# Altium schematic sheet baseband.SchDoc
size 297 x 209 mm
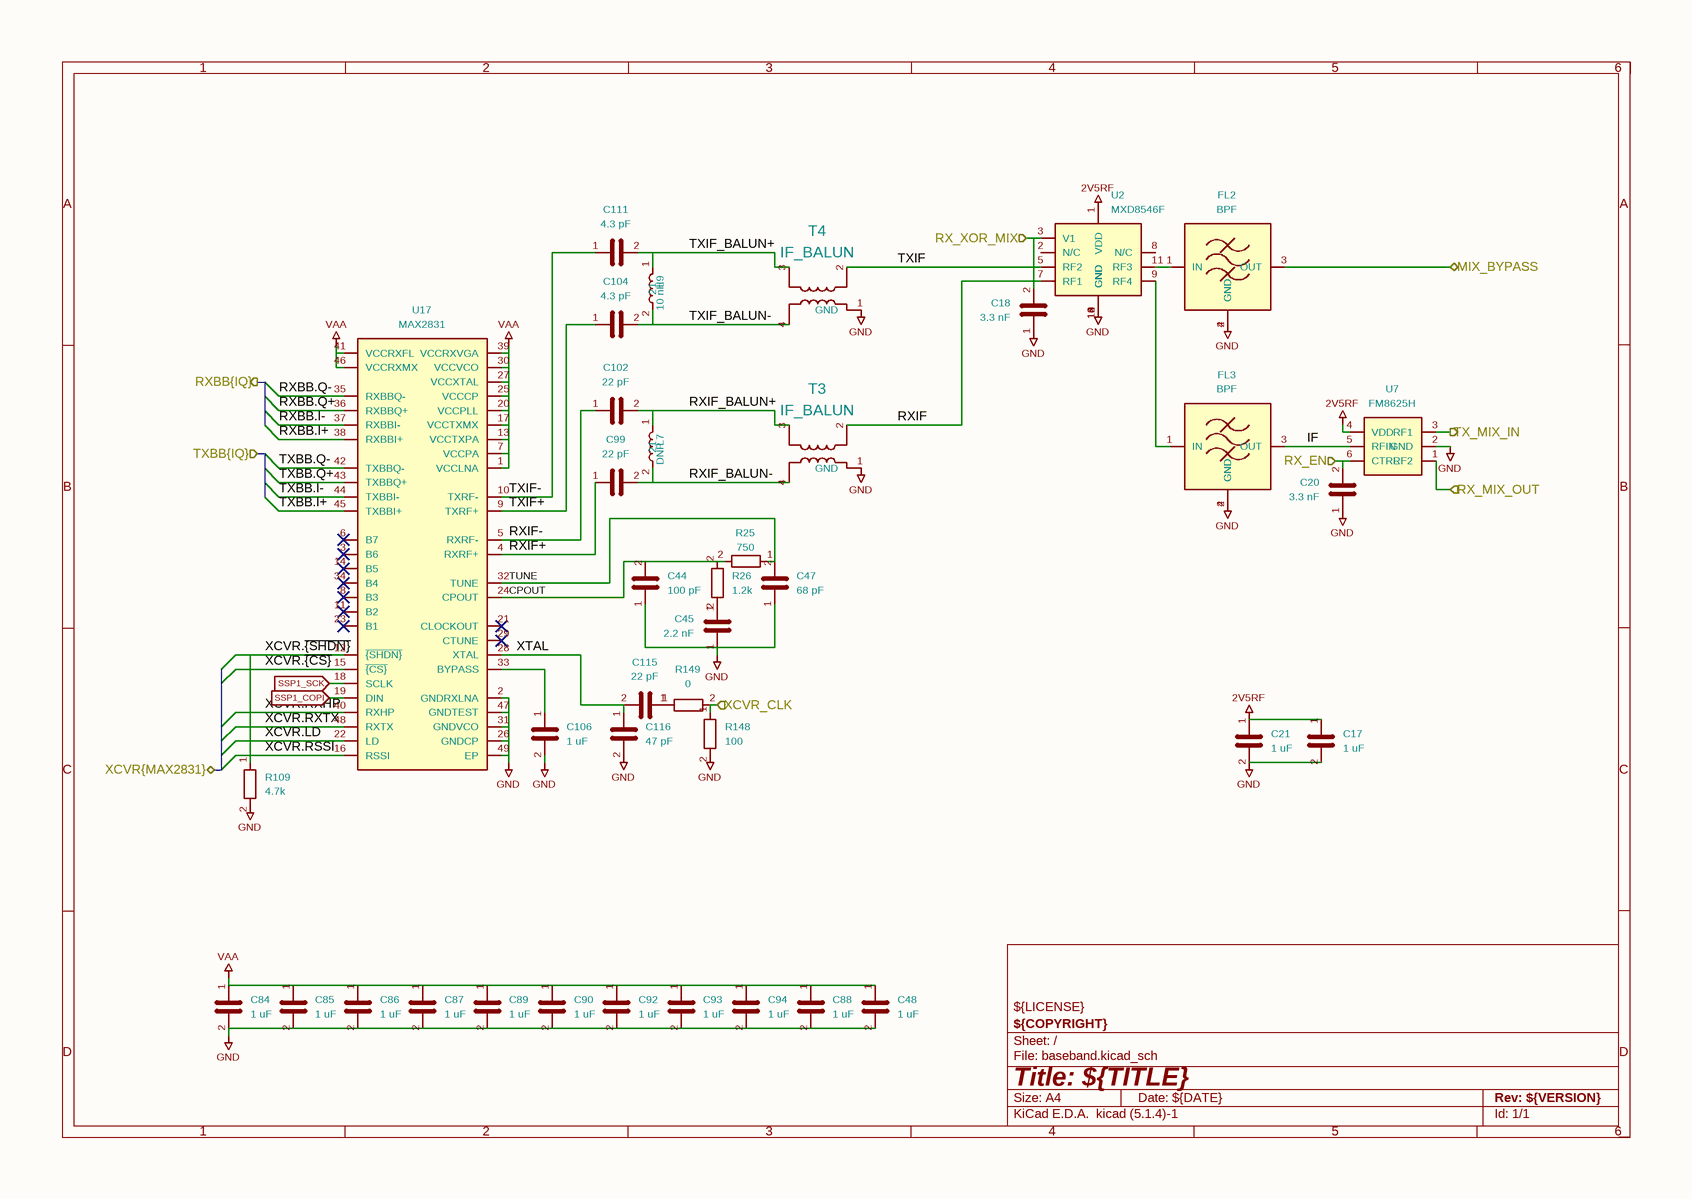
[diagram p0: baseband.SchDoc]

## Parts
C17  1 uF  [C_0201_0603Metric]
C18  3.3 nF  [C_0201_0603Metric]
C20  3.3 nF  [C_0201_0603Metric]
C21  1 uF  [C_0201_0603Metric]
C44  100 pF  [C_0201_0603Metric]
C45  2.2 nF  [C_0201_0603Metric]
C47  68 pF  [C_0201_0603Metric]
C48  1 uF  [C_0201_0603Metric]
C84  1 uF  [C_0201_0603Metric]
C85  1 uF  [C_0201_0603Metric]
C86  1 uF  [C_0201_0603Metric]
C87  1 uF  [C_0201_0603Metric]
C88  1 uF  [C_0201_0603Metric]
C89  1 uF  [C_0201_0603Metric]
C90  1 uF  [C_0201_0603Metric]
C92  1 uF  [C_0201_0603Metric]
C93  1 uF  [C_0201_0603Metric]
C94  1 uF  [C_0201_0603Metric]
C99  22 pF  [C_0201_0603Metric]
C102  22 pF  [C_0201_0603Metric]
C104  4.3 pF  [C_0201_0603Metric]
C106  1 uF  [C_0201_0603Metric]
C111  4.3 pF  [C_0201_0603Metric]
C115  22 pF  [C_0201_0603Metric]
C116  47 pF  [C_0201_0603Metric]
FL2  BPF  [Filter_Pulse_BPF1608LM09R5000A]
FL3  BPF  [Filter_Pulse_BPF1608LM09R5000A]
L7  DNP  [L_0201_0603Metric]
L9  10 nH  [L_0201_0603Metric]
R25  750  [R_0201_0603Metric]
R26  1.2k  [R_0201_0603Metric]
R109  4.7k  [R_0201_0603Metric]
R148  100  [R_0201_0603Metric]
R149  0  [R_0201_0603Metric]
T3  IF_BALUN  [Balun_TDK_TFSZ06052460-3310A2X]
T4  IF_BALUN  [Balun_TDK_TFSZ06052460-3310A2X]
U2  MXD8546F  [QFN-12-1EP_2x2mm_P0.5mm_EP1x1mm]
U7  FM8625H  [TSLP-6-4_1.1x0.7mm_P0.4mm]
U17  MAX2831  [QFN-48-1EP_7x7mm_P0.5mm_EP5.6x5.6mm_ThermalVias]

## Ports
MIX_BYPASS (bidir), RX_EN (in), RX_MIX_OUT (in), RX_XOR_MIX (in), RXBB{IQ} (out), SSP1_COPI (in), SSP1_SCK (in), TX_MIX_IN (out), TXBB{IQ} (in), XCVR_CLK (in), XCVR{MAX2831} (bidir)

## Nets
2V5RF: C17.1 C21.1 U2.1(VDD) U7.4(VDD)
GND: C17.2 C18.1 C20.1 C21.2 C44.1 C45.1 C47.1 C48.2 C84.2 C85.2 C86.2 C87.2 C88.2 C89.2 C90.2 C92.2 C93.2 C94.2 C106.2 C116.2 FL2.2(GND) FL2.4(GND) FL3.2(GND) FL3.4(GND) R109.2 R148.2 T3.1(GND) T4.1(GND) U2.4(GND) U2.6(GND) U2.10(GND) U2.12(GND) U2.13(GND) U7.2(GND) U17.2(GNDRXLNA) U17.26(GNDCP) U17.31(GNDVCO) U17.47(GNDTEST) U17.49(EP)
VAA: C48.1 C84.1 C85.1 C86.1 C87.1 C88.1 C89.1 C90.1 C92.1 C93.1 C94.1 U17.1(VCCLNA) U17.7(VCCPA) U17.13(VCCTXPA) U17.17(VCCTXMX) U17.20(VCCPLL) U17.25(VCCCP) U17.27(VCCXTAL) U17.30(VCCVCO) U17.39(VCCRXVGA) U17.41(VCCRXFL) U17.46(VCCRXMX)
CPOUT: C44.2 R25.2 R26.2 U17.24(CPOUT)
IF: FL3.3(OUT) U7.5(RFIN)
MIX_BYPASS: FL2.3(OUT) ; port MIX_BYPASS
RX_EN: C20.2 U7.6(CTRL) ; port RX_EN
RX_MIX_OUT: U7.1(RF2) ; port RX_MIX_OUT
RX_XOR_MIX: C18.2 U2.3(V1) ; port RX_XOR_MIX
RXBB.I+: U17.38(RXBBI+)
RXBB.I-: U17.37(RXBBI-)
RXBB.Q+: U17.36(RXBBQ+)
RXBB.Q-: U17.35(RXBBQ-)
RXIF: T3.2 U2.7(RF1)
RXIF+: C99.1 U17.4(RXRF+)
RXIF-: C102.1 U17.5(RXRF-)
RXIF_BALUN+: C102.2 L7.1 T3.3
RXIF_BALUN-: C99.2 L7.2 T3.4
SSP1_COPI: U17.19(DIN) ; port SSP1_COPI
SSP1_SCK: U17.18(SCLK) ; port SSP1_SCK
TUNE: C47.2 R25.1 U17.32(TUNE)
TX_MIX_IN: U7.3(RF1) ; port TX_MIX_IN
TXBB.I+: U17.45(TXBBI+)
TXBB.I-: U17.44(TXBBI-)
TXBB.Q+: U17.43(TXBBQ+)
TXBB.Q-: U17.42(TXBBQ-)
TXIF: T4.2 U2.5(RF2)
TXIF+: C104.1 U17.9(TXRF+)
TXIF-: C111.1 U17.10(TXRF-)
TXIF_BALUN+: C111.2 L9.1 T4.3
TXIF_BALUN-: C104.2 L9.2 T4.4
XCVR.LD: U17.22(LD)
XCVR.RSSI: U17.16(RSSI)
XCVR.RXHP: U17.40(RXHP)
XCVR.RXTX: U17.48(RXTX)
XCVR.~{{CS}}: U17.15(~{{CS}})
XCVR.~{{SHDN}}: R109.1 U17.12(~{{SHDN}})
XCVR_CLK: R148.1 R149.2 ; port XCVR_CLK
XTAL: C115.2 C116.1 U17.28(XTAL)
NetC45_2: C45.2 R26.1
NetC106_1: C106.1 U17.33(BYPASS)
NetC115_1: C115.1 R149.1
NetFL2_1: FL2.1(IN) U2.11(RF3)
NetFL3_1: FL3.1(IN) U2.9(RF4)

Not connected (* = marked no-connect by the designer): U2 2(N/C) 8(N/C); U17 3(B6)* 6(B7)* 8(B3)* 11(B2)* 14(B5)* 21(CLOCKOUT)* 23(B1)* 29(CTUNE)* 34(B4)*

## Notes on the sheet
- 1
- 2
- 3
- 4
- 5
- 6
- A
- B
- C
- ${LICENSE}
- D
- Title: ${TITLE}
- File: baseband.kicad_sch
- Sheet: /
- ${COPYRIGHT}
- KiCad E.D.A.  kicad (5.1.4)-1
- Size: A4
- Date: ${DATE}
- Rev: ${VERSION}
- Id: 1/1

## Library data of the parts
C17 C21 C48 C84-C90 C92-C94 C106 = C: Manufacturer: Murata; Part Number: GRM033R61A105ME44D; Description: CAP CER 1UF 10V X5R 0201; Substitution: GRM033R61A105ME44*, GRM033R61C105ME15*, Samsung CL03A105MO3NRN*; Value: 1 uF; Footprint: Capacitor_SMD:C_0201_0603Metric
C18 C20 = C: Manufacturer: Murata; Part Number: GRM033R71A332KA01D; Description: CAP CER 3300PF 10V X7R 0201; Substitution: GRM033R71A332K*; Value: 3.3 nF; Footprint: Capacitor_SMD:C_0201_0603Metric
C44 = C: Manufacturer: Murata; Part Number: GRM0335C1E101JA01D; Description: CAP CER 100PF 25V C0G/NP0 0201; Substitution: GRM0335C1E101JA01*, GRM0335C1H101JA01*; Value: 100 pF; Footprint: Capacitor_SMD:C_0201_0603Metric
C45 = C: Manufacturer: Murata; Part Number: GRM033R71A222KA01D; Description: CAP CER 2200PF 10V X7R 0201; Substitution: GRM033R71A222KA01*; Value: 2.2 nF; Footprint: Capacitor_SMD:C_0201_0603Metric
C47 = C: Manufacturer: Murata; Part Number: GRM0335C1H680JA01D; Description: CAP CER 68PF 50V C0G/NP0 0201; Substitution: GRM0335C1H680JA01*; Value: 68 pF; Footprint: Capacitor_SMD:C_0201_0603Metric
C99 C102 C115 = C: Manufacturer: Murata; Part Number: GRM0335C1H220JA01D; Description: CAP CER 22PF 50V C0G/NP0 0201; Substitution: GRM0335C1H220*; Value: 22 pF; Footprint: Capacitor_SMD:C_0201_0603Metric
C104 C111 = C: Manufacturer: Murata; Part Number: GRM0335C1E4R3CA01D; Description: CAP CER 4.3PF 25V C0G/NP0 0201; Substitution: GRM0335C1E4R3*, GRM0335C1H4R3*; Value: 4.3 pF; Footprint: Capacitor_SMD:C_0201_0603Metric
C116 = C: Manufacturer: Murata; Part Number: GRM0335C1E470JA01D; Description: CAP CER 47PF 25V C0G/NP0 0201; Substitution: GRM0335C1E470JA01*, GRM0335C1H470JA01*; Value: 47 pF; Footprint: Capacitor_SMD:C_0201_0603Metric
FL2 FL3 = BFCN-1445: Manufacturer: Pulse Electronics; Part Number: BPF1608LM02R2400A; Description: RF FILTER BAND PASS 2.45GHZ 0603; Value: BPF; Footprint: praline:Filter_Pulse_BPF1608LM09R5000A
L7 = L: Value: DNP; Footprint: Inductor_SMD:L_0201_0603Metric
L9 = L: Manufacturer: Murata; Part Number: LQP03TN10NJ02D; Description: FIXED IND 10NH 250MA 700MOHM SMD; Substitution: LQP03TN10NH02D; Value: 10 nH; Footprint: Inductor_SMD:L_0201_0603Metric
R25 = R: Manufacturer: Yageo; Part Number: RC0201JR-07750RL; Description: RES 750 OHM 5% 1/20W 0201; Substitution: any equivalent; Value: 750; Footprint: Resistor_SMD:R_0201_0603Metric
R26 = R: Manufacturer: Yageo; Part Number: RC0201JR-071K2L; Description: RES 1.2K OHM 5% 1/20W 0201; Substitution: any equivalent; Value: 1.2k; Footprint: Resistor_SMD:R_0201_0603Metric
R109 = R: Manufacturer: Yageo; Part Number: RC0201FR-074K7L; Description: RES 4.7K OHM 1% 1/20W 0201; Substitution: any equivalent; Value: 4.7k; Footprint: Resistor_SMD:R_0201_0603Metric
R148 = R: Manufacturer: Yageo; Part Number: RC0201JR-07100RL; Description: RES 100 OHM 5% 1/20W 0201; Substitution: any equivalent; Value: 100; Footprint: Resistor_SMD:R_0201_0603Metric
R149 = R: Manufacturer: Yageo; Part Number: RC0201JR-070RL; Description: RES 0 OHM JUMPER 1/20W 0201; Substitution: any equivalent; Value: 0; Footprint: Resistor_SMD:R_0201_0603Metric
T3 T4 = TFSZ06052460-3310A2X: Manufacturer: TDK; Description: Thin-Film Balun for 2300-2690MHz; Part Number: TFSZ06052460-3310A2X; Value: IF_BALUN; Footprint: praline:Balun_TDK_TFSZ06052460-3310A2X
U2 = MXD8546F: Manufacturer: Maxscend; Description: X-DPDT RF SWITCH; Part Number: MXD8546F; Value: MXD8546F; Footprint: praline:QFN-12-1EP_2x2mm_P0.5mm_EP1x1mm
U7 = BGS12P2L6: Manufacturer: Shenzhen Fuman; Description: SPDT RF SWITCH; Part Number: FM8625H; Value: FM8625H; Footprint: praline:TSLP-6-4_1.1x0.7mm_P0.4mm
U17 = MAX2831: Manufacturer: Maxim; Part Number: MAX2831ETM+T; Description: IC RF TXRX WIFI 48TQFN; Substitution: MAX2831ETM+; Value: MAX2831; Footprint: praline:QFN-48-1EP_7x7mm_P0.5mm_EP5.6x5.6mm_ThermalVias